# EasyEDA Pro project gorb.eprj, board PCB带接收器
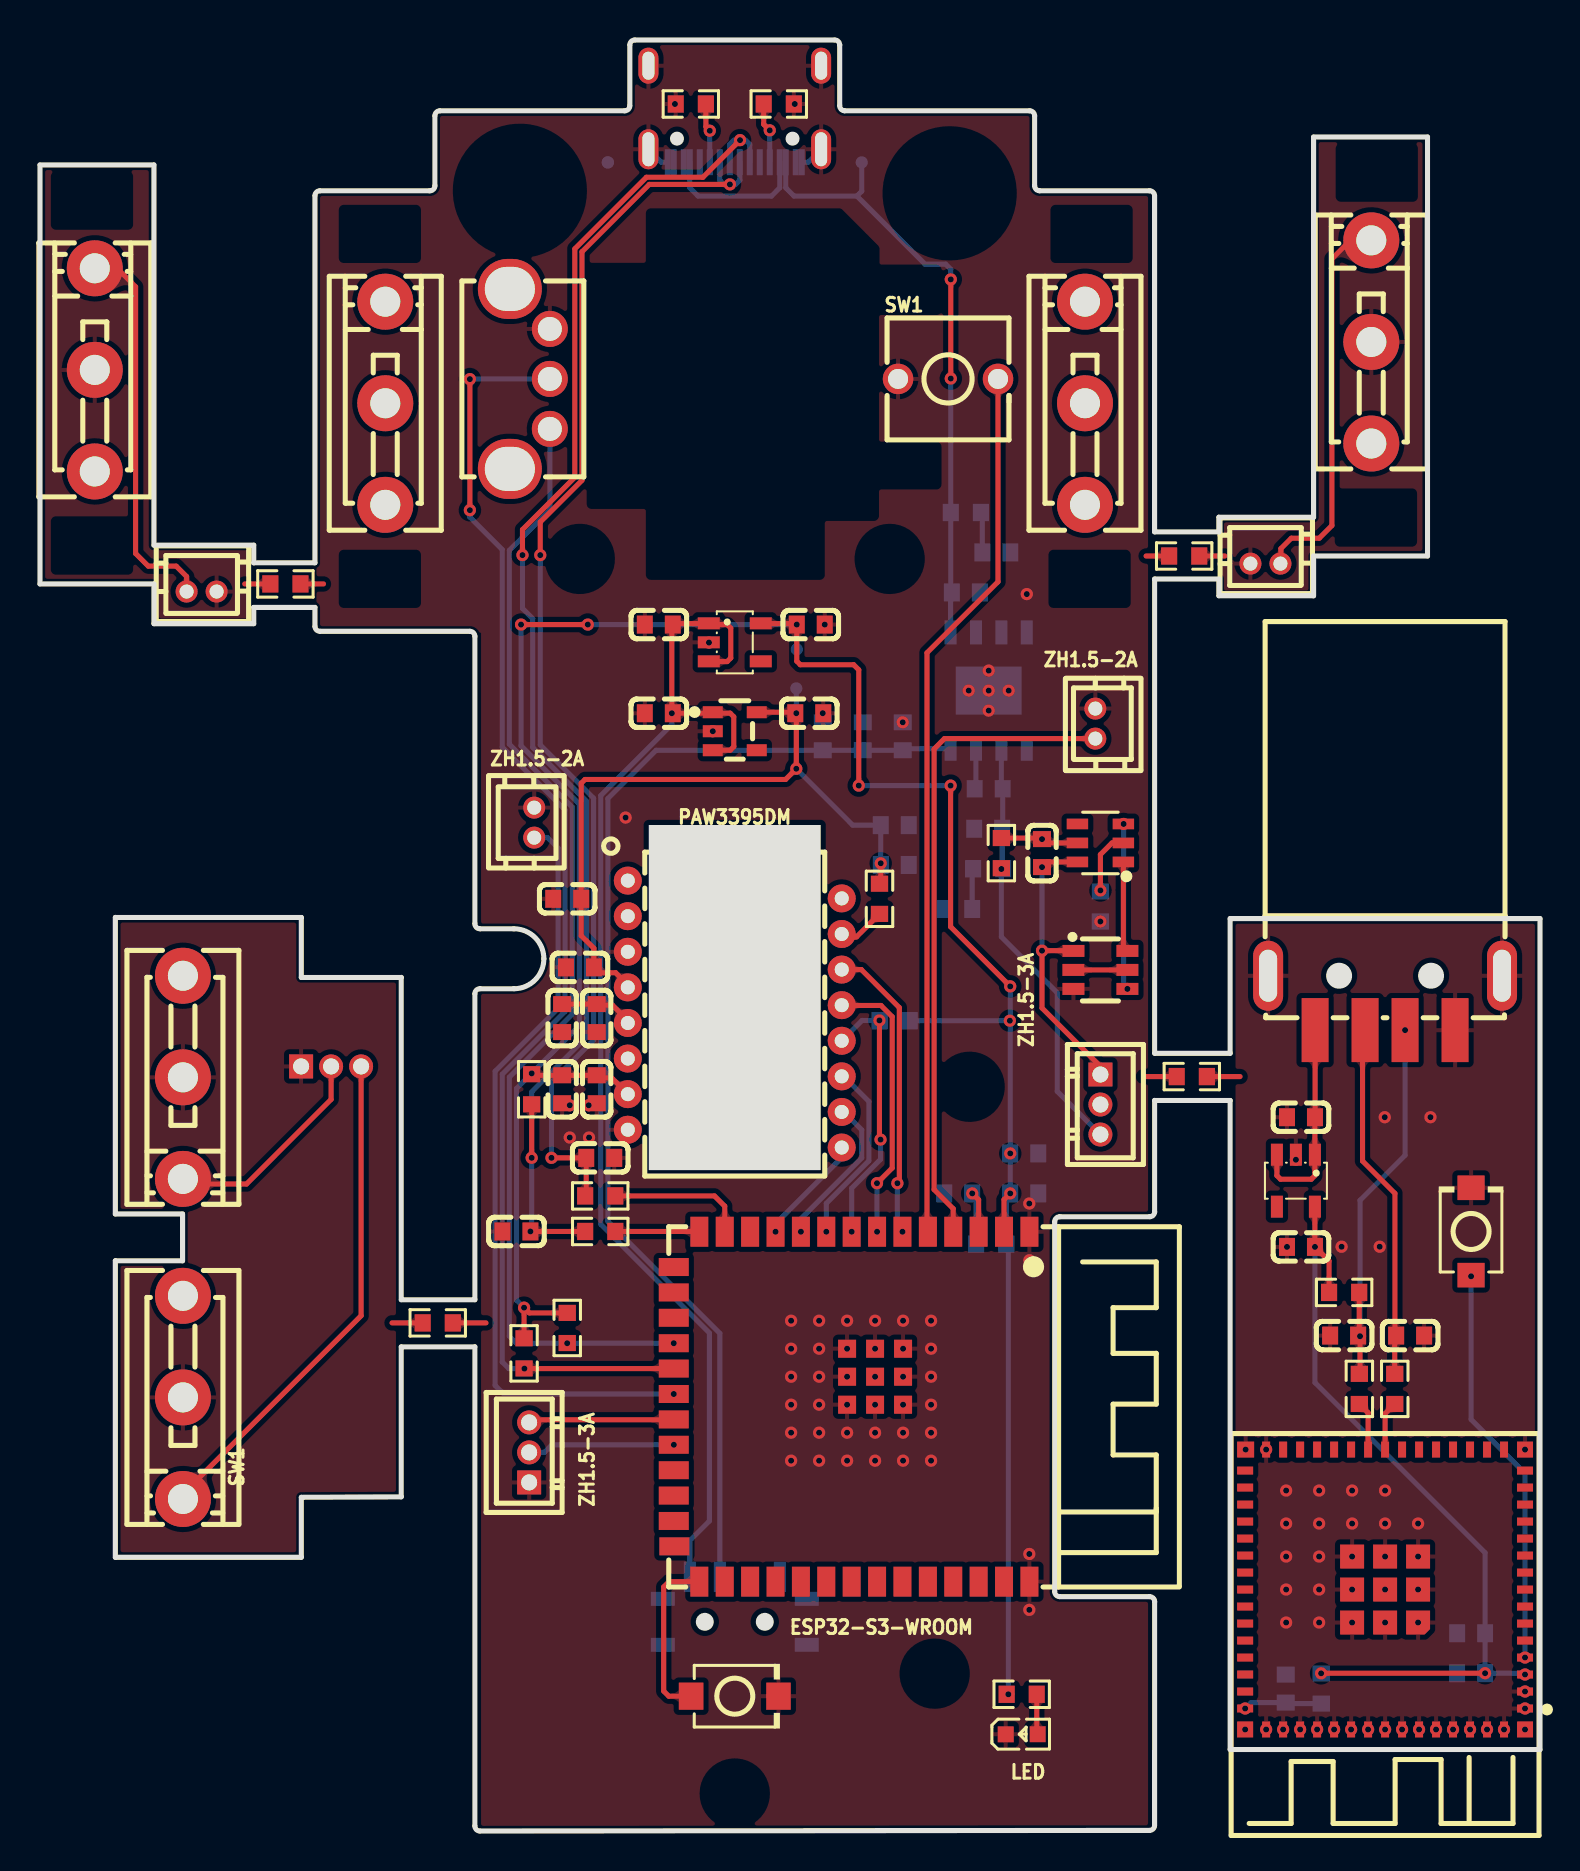
[diagram p3: board, top side]
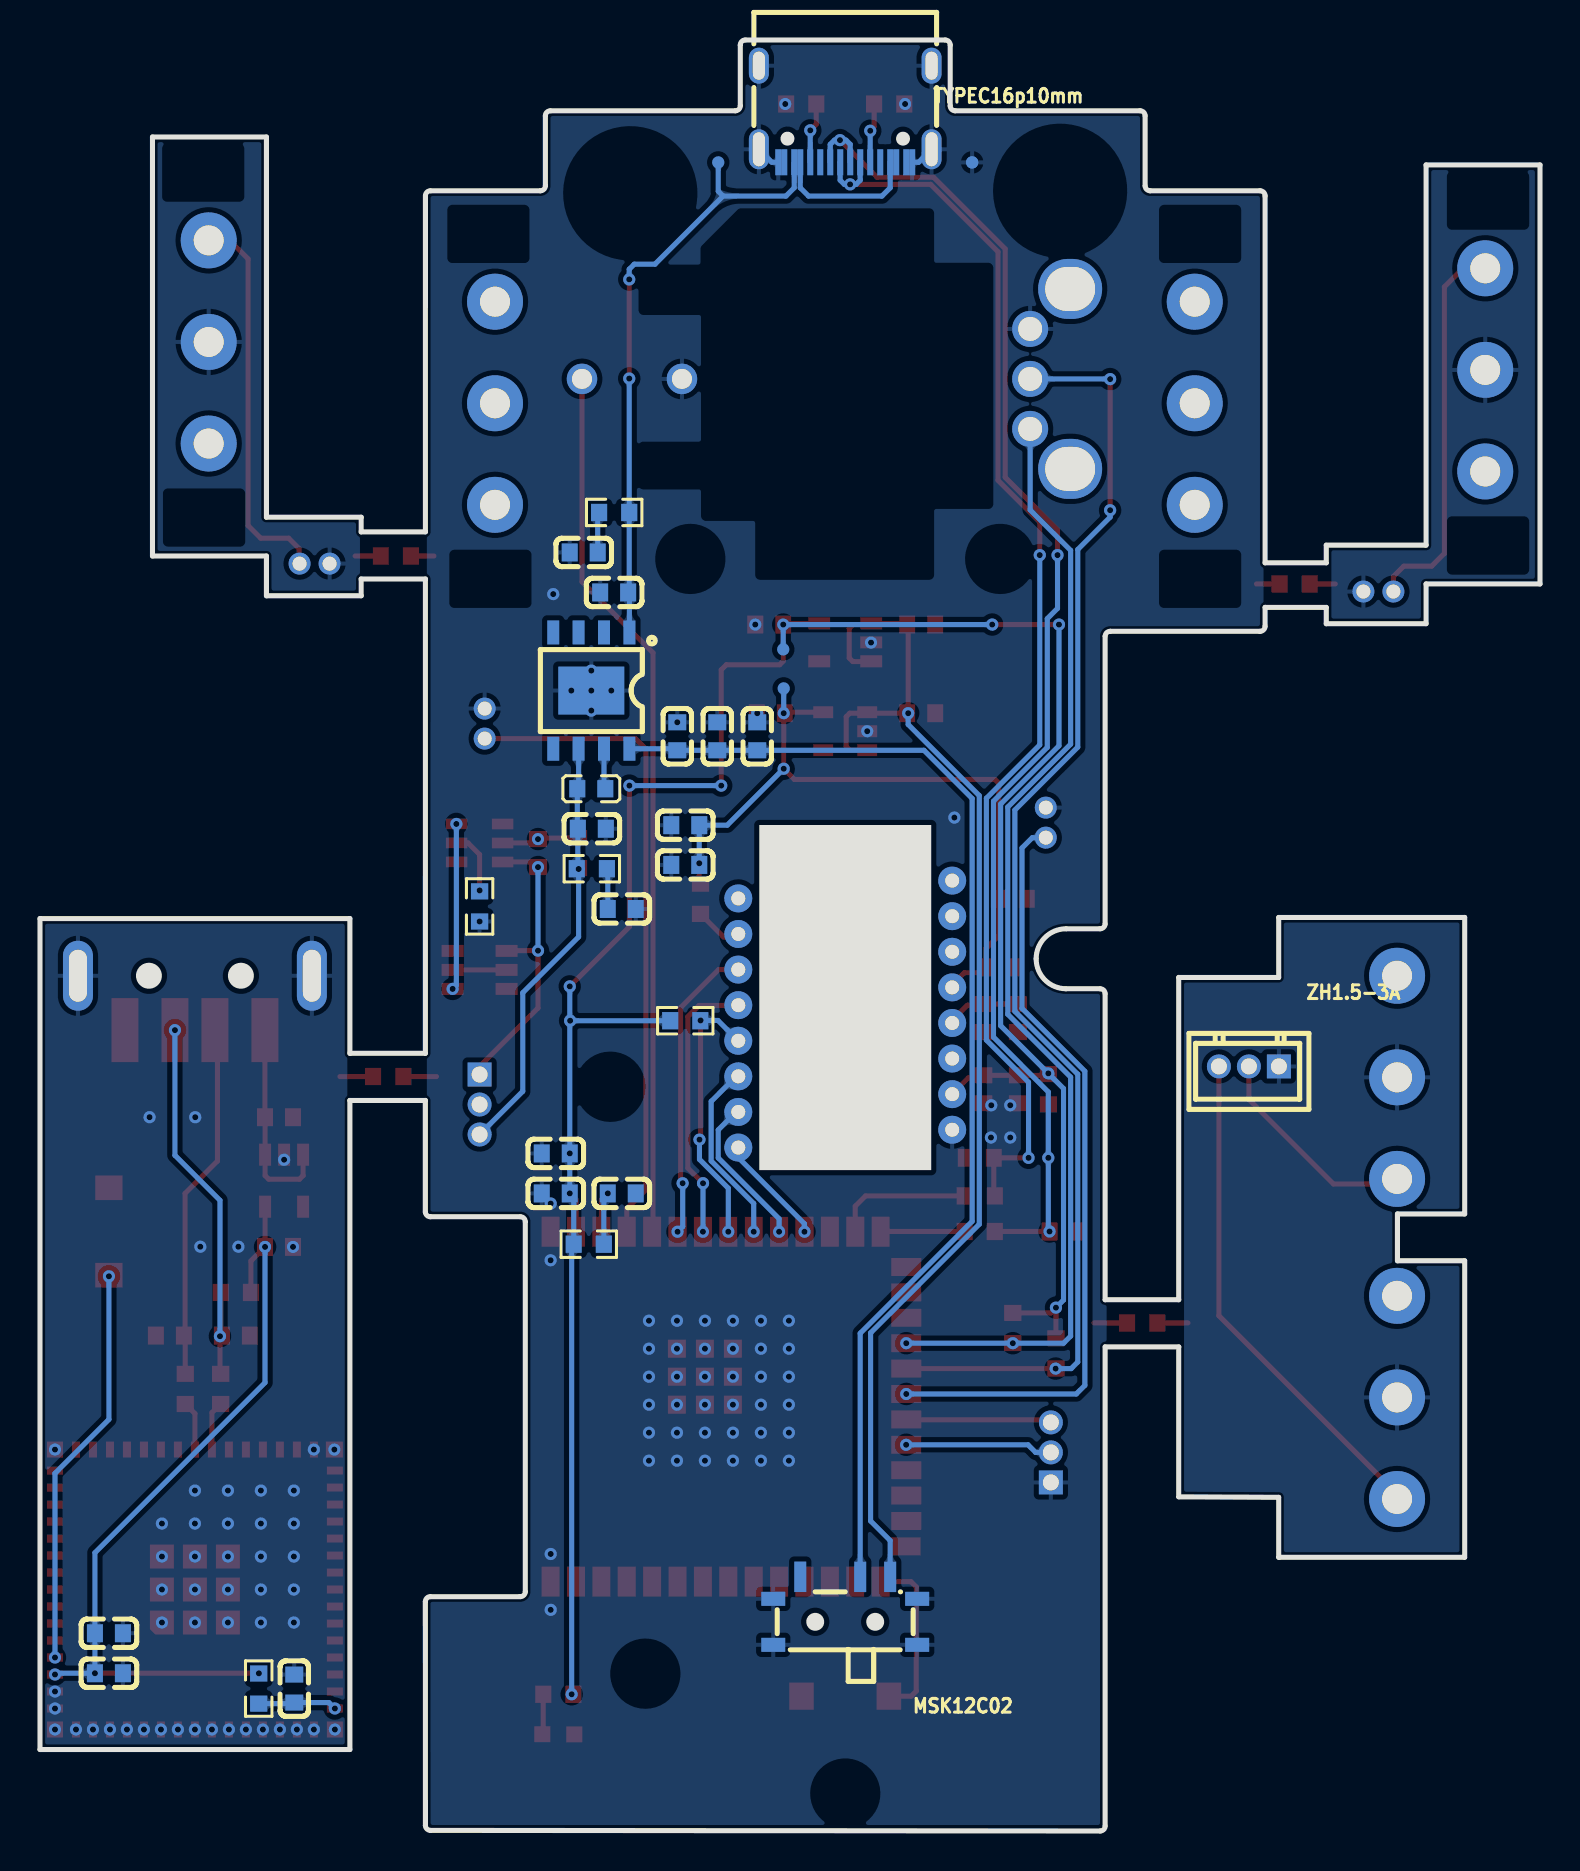
[diagram p4: board, bottom side, seen from below]

Outline 75.03 x 89.57 mm; copper layers: Top Layer, Bottom Layer. Coordinates in mm from the lower left corner of the outline.
Outline path: 0,83.32 5.7,83.32 5.7,64.31 10.69,64.31 10.69,63.42 13.75,63.42 13.75,81.78 arc(13.83,81.96) 14,82.03 19.5,82.03 arc(19.68,82.11) 19.75,82.28 19.75,85.78 arc(19.83,85.96) 20,86.03 29.25,86.03 arc(29.43,86.11) 29.5,86.28 29.5,89.32 arc(29.58,89.5) 29.75,89.57 39.75,89.57 arc(39.93,89.5) 40,89.32 40,86.28 arc(40.08,86.11) 40.25,86.03 49.5,86.03 arc(49.68,85.96) 49.75,85.78 49.75,82.28 arc(49.83,82.11) 50,82.03 55.5,82.03 arc(55.68,81.96) 55.75,81.78 55.75,64.97 58.97,64.97 58.97,65.71 63.71,65.71 63.71,84.72 69.41,84.72 69.41,63.77 63.71,63.77 63.71,61.78 58.97,61.78 58.97,62.62 55.75,62.62 55.76,38.89 59.53,38.89 59.53,45.63 75.03,45.63 75.03,4.08 59.53,4.08 59.53,36.54 55.76,36.54 55.76,30.96 arc(55.68,30.79) 55.51,30.72 51.01,30.72 arc(50.83,30.65) 50.76,30.47 50.76,11.97 arc(50.83,11.79) 51.01,11.72 55.51,11.72 arc(55.68,11.65) 55.76,11.47 55.75,0.28 arc(55.68,0.1) 55.5,0.03 22,0 arc(21.83,0.07) 21.75,0.25 21.75,24.21 18.07,24.21 18.07,16.71 13.07,16.69 13.07,13.69 3.77,13.69 3.77,28.52 7.13,28.52 7.13,30.86 3.77,30.86 3.77,45.69 13.07,45.69 13.07,42.69 18.07,42.69 18.07,26.57 21.75,26.57 21.75,41.87 arc(21.83,42.05) 22,42.12 23.7,42.12 arc(24.77,42.56) 25.2,43.62 arc(24.77,44.68) 23.7,45.12 22,45.12 arc(21.83,45.2) 21.75,45.37 21.75,59.75 arc(21.68,59.93) 21.5,60 14,60 arc(13.83,60.07) 13.75,60.25 13.75,61.2 10.69,61.2 10.69,60.38 5.7,60.38 5.7,62.37 0,62.37 0,83.32
Stack: Top Layer 0.035mm / Dielectric1 1.51mm FR4 er 4.5 / Bottom Layer 0.035mm

## Design rules (mm)
template: JLCPCB Capability(Two Layers Board)
spacing copperThickness1oz (default): track to track 0.102, other pairs 0.152 to 0.3
spacing copperThickness2oz: track to track 0.203, other pairs 0.152 to 0.3
track width copperThickness1oz (default): min 0.127, default 0.254, max 2.54
track width copperThickness2oz: min 0.203, default 0.254, max 2.54
differential pair differentialPair (default): width min 0.127, default 0.254, max 2.54; gap min 0.152, default 0.152
via viaSize (default): diameter min 0.5, default 0.61, max 10; hole min 0.3, default 0.305, max 6.3

## Placement (name value [footprint] x y rotation side)
C1  0.1uF  [C0603]  50.12 48.91 90 top
C2  -  [C0603]  43.16 54.75 90 bottom
C2#2  -  [C0603]  41.16 54.75 90 bottom
C21  22uF  [C0603]  39.16 54.75 90 bottom
C22  10uF  [C0603]  46.31 61.94 180 bottom
C23  -  [C0603]  45.93 46.11 0 bottom
C23#2  -  [C0603]  47.84 63.94 180 bottom
C24  10uF  [C0603]  47.43 50.13 180 bottom
C25  -  [C0603]  63.08 35.7 0 top
C25#2  -  [C0603]  63.08 29.21 0 top
C25#3  -  [C0603]  30.95 55.9 0 top
C25#4  -  [C0603]  38.48 55.9 0 top
C25#5  -  [C0603]  38.56 60.34 0 top
C25#6  -  [C0603]  30.95 60.34 0 top
C26  -  [C0603]  49.23 31.89 0 bottom
C26#2  -  [C0603]  71.59 7.89 180 bottom
C27  -  [C0603]  71.59 9.89 180 bottom
C27#2  -  [C0603]  49.23 33.89 0 bottom
C28  0.1uF  [C0603]  45.93 31.89 180 bottom
C29  12pF  [C0603]  23.83 29.98 0 top
C30  12pF  [C0603]  28.02 33.67 0 top
C31  -  [C0603]  26.12 37.1 270 top
C31#2  -  [C0603]  27.85 37.1 270 top
C31#3  -  [C0603]  27.85 40.66 270 top
C31#4  -  [C0603]  26.12 40.66 270 top
C32  0.1uF  [C0603]  27.01 43.19 0 top
C33  10uF  [C0603]  26.37 46.62 0 top
C34  -  [C0603]  42.76 50.3 180 bottom
C34#2  -  [C0603]  42.76 48.32 180 bottom
C35  12pF  [C0603]  65.23 24.78 0 top
C36  12pF  [C0603]  68.54 24.78 0 top
C37  0.1uF  [C0603]  62.31 7.12 270 bottom
ESP32-S3-WROOM  ESP32-S3-WROOM-1-N16R8  [WIRELM-SMD_ESP32-S3-WROOM-1]  40.6 21.22 270 top
LED  LED灯,0603,红色  [LED0603-RD_RED]  49.11 4.84 0 top
MSK12C02  MSK12C02  [SW-TH_MSK12C02]  34.75 11.01 180 bottom
NOREF  -  [Pad_e11927]  37.83 57.14 0 top
NOREF#2  -  [Pad_e13684]  28.41 83.45 0 top
NOREF#3  -  [Pad_e11570]  37.85 59.1 0 top
NOREF#4  -  [Pad_e13683]  28.41 83.45 0 top
NOREF#5  -  [Pad_e13609]  41.1 83.45 0 top
PAW3395DM  PAW3395DM-T6QU  [DIP-16_PAW3395DM-T6QU]  34.75 40.86 0 top
Q1  8205A  [SOT-23-6_L2.9-W1.6-P0.95-LS2.8-BR]  53.04 43.06 180 top
R2  5.1kΩ  [R0603]  32.56 86.37 180 top
R3  5.1kΩ  [R0603]  36.95 86.37 180 top
R4  1kΩ  [R0603]  53.04 46.24 90 bottom
R5  100Ω  [R0603]  48.09 48.91 90 top
R6  -  [R0603]  47.43 48.13 0 bottom
R6#2  -  [R0603]  46.31 65.94 180 bottom
R7  10kΩ  [R0603]  47.58 29.35 180 bottom
R8  -  [R0603]  24.59 37.1 90 top
R8#2  -  [R0603]  65.23 26.94 180 top
R9  22Ω  [R0603]  28.02 29.98 0 top
R10  22Ω  [R0603]  28.02 31.76 0 top
R11  10kΩ  [R0603]  24.21 23.89 90 top
R12  10kΩ  [R0603]  26.37 25.16 90 top
R13  5.6Ω  [R0603]  41.99 46.62 90 top
R14  10kΩ  [R0603]  42.76 40.53 180 bottom
R16  -  [R0603]  66 22.11 90 top
R16#2  -  [R0603]  67.76 22.11 90 top
R17  10kΩ  [R0603]  64.09 7.12 90 bottom
R19  1kΩ  [R0603]  49.11 6.84 0 top
R20  -  [R0603]  19.9 25.41 0 top
R20#2  -  [R0603]  57.62 37.73 0 top
R21  0  [R0603]  12.28 62.37 0 top
R22  0  [R0603]  57.23 63.77 0 top
SW1  -  [SW-TH_K9-1267T]  7.15 21.69 270 top
SW1#2  -  [SW-TH_L6.2-W6.2-P5.00]  45.42 72.62 0 top
SW2  -  [SW-TH_K9-1267T]  7.15 37.69 270 top
SW2#2  -  [SW-TH_K9-1267T]  52.27 71.41 90 top
SW3  -  [SW-SMD_L3.9-W3.0-P4.45]  34.75 6.74 0 top
SW3#2  -  [SW-SMD_L3.9-W3.0-P4.45]  71.59 29.98 90 top
SW3#3  -  [SW-TH_K9-1267T]  2.74 73.07 90 top
SW3#4  -  [SW-TH_K9-1267T]  66.59 74.47 90 top
SW3#5  -  [SW-TH_K9-1267T]  17.27 71.41 90 top
SW4  EC10E1220501  [SW-TH_EC10EXXXXXXX]  24.5 72.62 90 top
TYPEC16p10mm  -  [USB-C-SMD_KH-TYPE-C-16P]  34.75 85.87 0 bottom
U6  IP5306  [ESOP-8_L4.9-W3.9-P1.27-LS6.0-BL-EP]  47.45 57.03 0 bottom
U8  DW01A  [SOT-23-6_L2.9-W1.6-P0.95-LS2.8-BL]  53.04 49.42 90 top
U10  TLV75519PDBVR  [SOT-23-5_L2.9-W1.6-P0.95-LS2.8-BR]  34.75 55 180 top
U11  1uH  [L0603]  47.45 52.13 180 bottom
U12  2.4GHz  [WIFI-SMD_ESP32-MINI-1-N4]  67.28 12.08 180 top
U15  -  [SOT-23-5_L3.0-W1.7-P0.95-LS2.8-BR]  34.75 59.45 180 top
U15#2  -  [SOT-23-5_L3.0-W1.7-P0.95-LS2.8-BR]  62.82 32.52 90 top
USB1  AM 180°  [USB-SMD_AM180]  67.28 41.41 180 top
ZH1.5-2A  -  [CONN-TH_ZH-1.5-2A]  24.72 50.43 90 top
ZH1.5-2A#2  -  [CONN-TH_ZH-1.5-2A]  52.79 55.38 270 top
ZH1.5-2A#3  -  [CONN-TH_ZH-1.5-2A]  8.08 61.99 0 top
ZH1.5-2A#4  -  [CONN-TH_ZH-1.5-2A]  61.3 63.39 0 top
ZH1.5-3A  -  [CONN-TH_ZH1.5-3A]  24.47 18.94 90 top
ZH1.5-3A#2  -  [CONN-TH_ZH1.5-3A]  53.04 36.33 270 top
ZH1.5-3A#3  -  [CONN-TH_ZH1.5-3A]  14.56 38.24 0 bottom

## Footprints (pads in the part's own frame, mm; a bottom-side part is the same pattern mirrored in y, then rotated)
C0603
  rect 0.8x0.9 smd: 1(-0.7,0) 2(0.7,0)
CONN-TH_ZH1.5-3A
  rect 1.2x1.2 hole 0.8: 1(-1.5,0)
  round 1.2 hole 0.8: 2(0.001,0) 3(1.5,0)
CONN-TH_ZH-1.5-2A
  round 1.1 hole 0.7: 1(-0.75,0) 2(0.75,0)
DIP-16_PAW3395DM-T6QU
  round 1.4 hole 0.7: 1(-5.35,6.675) 2(-5.35,4.895) 3(-5.35,3.115) 4(-5.35,1.335) 5(-5.35,-0.445) 6(-5.35,-2.225) 7(-5.35,-4.005) 8(-5.35,-5.785) 9(5.35,-6.675) 10(5.35,-4.895) 11(5.35,-3.115) 12(5.35,-1.335) 13(5.35,0.445) 14(5.35,2.225) 15(5.35,4.005) 16(5.35,5.785)
ESOP-8_L4.9-W3.9-P1.27-LS6.0-BL-EP
  rect 0.6x1.2 smd: 1(-1.905,-2.909) 2(-0.635,-2.909) 3(0.635,-2.909) 4(1.905,-2.909) 5(1.905,2.909) 6(0.635,2.909) 7(-0.635,2.909) 8(-1.905,2.909)
  rect 3.3x2.4 smd: 9(0,0)
L0603
  rect 0.8x0.864 smd: 1(-0.7,0) 2(0.7,0)
LED0603-RD_RED
  rect 0.8x0.8 smd: 1(-0.799,-0.004) 2(0.799,0.004)
Pad_e11570
  round 0.61 smd far side: (0,0)
Pad_e11927
  round 0.61 smd far side: (0,0)
Pad_e13609
  round 0.61 smd far side: TP2(0,0)
Pad_e13683
  round 0.61 smd far side: TP3(0,0)
Pad_e13684
  round 0.61 smd far side: TP4(0,0)
R0603
  rect 0.806x0.864 smd: 1(-0.753,0) 2(0.753,0)
SOT-23-5_L2.9-W1.6-P0.95-LS2.8-BR
  rect 1x0.6 smd: 1(1.1,-0.95) 2(1.1,0) 3(1.1,0.95) 4(-1.1,0.95) 5(-1.1,-0.95)
SOT-23-5_L3.0-W1.7-P0.95-LS2.8-BR
  rect 1.1x0.6 smd: 1(1.3,-0.95) 2(1.3,0) 3(1.3,0.95) 4(-1.3,0.95) 5(-1.3,-0.95)
SOT-23-6_L2.9-W1.6-P0.95-LS2.8-BL
  rect 0.532x1.072 smd: 1(-0.95,-1.149) 2(0,-1.149) 3(0.95,-1.149) 4(0.95,1.149) 5(0,1.149) 6(-0.95,1.149)
SOT-23-6_L2.9-W1.6-P0.95-LS2.8-BR
  rect 1.1x0.6 smd: 1(1.35,-0.95) 2(1.35,0) 3(1.35,0.95) 4(-1.35,0.95) 5(-1.35,0) 6(-1.35,-0.95)
SW-SMD_L3.9-W3.0-P4.45
  rect 1.23x1.36 smd: 1(-2.185,0) 2(2.185,0)
SW-TH_EC10EXXXXXXX
  oval 3x3.2 hole 2.2x2.5: 4(-4.5,1) 5(4.5,1)
  round 1.8 hole 1.2: A(-2.5,-1) B(0,-1) C(2.5,-1)
SW-TH_K9-1267T
  round 2.8 hole 1.5: 1(-5.08,0) 2(0,0) 3(5.08,0)
SW-TH_L6.2-W6.2-P5.00
  round 1.524 hole 1: 1(-2.5,0) 2(2.5,0)
SW-TH_MSK12C02
  rect 0.6x1.524 smd: 1(-2.25,1.7) 2(0.75,1.7) 3(2.25,1.7)
  rect 1.2x0.7 smd: 4(-3.6,-1.7) 4(-3.6,0.6) 4(3.6,-1.7) 4(3.6,0.6)
USB-C-SMD_KH-TYPE-C-16P
  oval 1x2 hole 0.6x1.7: 1(-4.32,1.765) 2(4.32,1.765)
  oval 1x1.8 hole 0.6x1.4: 3(-4.32,-2.415) 4(4.32,-2.415)
  rect 0.3x1.3 smd: A1(-3.35,2.415) A4(-2.55,2.415) A5(-1.25,2.415) A6(-0.25,2.415) A7(0.25,2.415) A8(1.25,2.415) A9(2.55,2.415) A12(3.35,2.415) B1(3.05,2.415) B4(2.25,2.415) B5(1.75,2.415) B6(0.75,2.415) B7(-0.75,2.415) B8(-1.75,2.415) B9(-2.25,2.415) B12(-3.05,2.415)
USB-SMD_AM180
  rect 1.35x3.2 smd: 1(3.5,1.36) 2(1,1.36) 3(-1,1.36) 4(-3.5,1.36)
  oval 1.5x3.5 hole 0.9x2.6: 5(-5.85,-1.36) 5(5.85,-1.36)
WIFI-SMD_ESP32-MINI-1-N4
  rect 0.8x0.4 smd: 1(-7,5.95) 2(-7,5.1) 3(-7,4.25) 4(-7,3.4) 5(-7,2.55) 6(-7,1.7) 7(-7,0.85) 8(-7,0.001) 9(-7,-0.85) 10(-7,-1.7) 11(-7,-2.55) 12(-7,-3.4) 13(-7,-4.25) 14(-7,-5.1) 15(-7,-5.949) 31(7,-5.95) 32(7,-5.1) 33(7,-4.25) 34(7,-3.4) 35(7,-2.55) 36(7,-1.7) 37(7,-0.85) 38(7,-0.001) 39(7,0.85) 40(7,1.7) 41(7,2.55) 42(7,3.4) 43(7,4.25) 44(7,5.1) 45(7,5.949)
  rect 0.4x0.8 smd: 16(-5.95,-7) 17(-5.1,-7) 18(-4.25,-7) 19(-3.4,-7) 20(-2.55,-7) 21(-1.7,-7) 22(-0.85,-7) 23(-0.001,-7) 24(0.85,-7) 25(1.7,-7) 26(2.55,-7) 27(3.4,-7) 28(4.25,-7) 29(5.1,-7) 30(5.949,-7) 46(5.95,7) 47(5.1,7) 48(4.25,7) 49(3.4,7) 50(2.55,7) 51(1.7,7) 52(0.85,7) 53(0,7) 54(-0.85,7) 55(-1.7,7) 56(-2.55,7) 57(-3.4,7) 58(-4.25,7) 59(-5.1,7) 60(-5.95,7)
  custom 1.2x1.2 smd: 61(-1.65,1.65)
  rect 1.2x1.2 smd: 61(-1.65,0) 61(-1.65,-1.65) 61(0,1.65) 61(0,0) 61(0,-1.65) 61(1.649,-1.65) 61(1.65,1.65) 61(1.65,0)
  rect 0.8x0.8 smd: 62(-7,7) 63(-7,-7) 65(7,7)
  rect 0.85x0.8 smd: 64(6.975,-7)
WIRELM-SMD_ESP32-S3-WROOM-1
  rect 1.5x0.9 smd: 1(-8.75,8.895) 2(-8.75,7.625) 3(-8.75,6.355) 4(-8.75,5.085) 5(-8.75,3.815) 6(-8.75,2.545) 7(-8.75,1.275) 8(-8.75,0.005) 9(-8.75,-1.265) 10(-8.75,-2.535) 11(-8.75,-3.805) 12(-8.75,-5.075) 13(-8.75,-6.345) 14(-8.75,-7.615) 27(8.75,-7.615) 28(8.75,-6.345) 29(8.75,-5.075) 30(8.75,-3.805) 31(8.75,-2.535) 32(8.75,-1.265) 33(8.75,0.005) 34(8.75,1.275) 35(8.75,2.545) 36(8.75,3.815) 37(8.75,5.085) 38(8.75,6.355) 39(8.75,7.625) 40(8.75,8.895)
  rect 0.9x1.5 smd: 15(-6.985,-8.895) 16(-5.715,-8.895) 17(-4.445,-8.895) 18(-3.175,-8.895) 19(-1.905,-8.895) 20(-0.635,-8.895) 21(0.635,-8.895) 22(1.905,-8.895) 23(3.175,-8.895) 24(4.445,-8.895) 25(5.715,-8.895) 26(6.985,-8.865)
  rect 0.9x0.9 smd: 41(-2.9,2.575) 41(-2.9,1.175) 41(-2.9,-0.225) 41(-1.5,2.575) 41(-1.5,1.175) 41(-1.5,-0.225) 41(-0.1,2.575) 41(-0.1,1.175) 41(-0.1,-0.225)

## Nets
1V9: C25#4.1 C32.2 C33.2 C34.2 C34#2.2 NOREF. PAW3395DM.4 R13.2 U10.5
3V3: C25#5.1 C26.1 C27#2.1 C31.1 C31#2.1 ESP32-S3-WROOM.2 NOREF#3. PAW3395DM.7 R7.1 R8.2 R11.2 R12.2 R14.1 R19.1 U15.5
3V3_2: C25#2.2 C26#2.1 C27.1 R8#2.2 R17.2 U12.3 U15#2.5
5V: C22.2 NOREF#5.TP2 R6#2.2 TYPEC16p10mm.A4 TYPEC16p10mm.A9 TYPEC16p10mm.B4 TYPEC16p10mm.B9 U6.1
5V_2: C25.2 U15#2.1 U15#2.3 USB1.1
GND: C2.2 C2#2.2 C21.2 C22.1 C23.1 C23#2.1 C24.2 C25#3.1 C25#4.2 C25#5.2 C25#6.1 C26.2 C27#2.2 C29.1 C30.2 C31.2 C31#2.2 C31#3.2 C31#4.2 C32.1 C33.1 C34.1 C34#2.1 ESP32-S3-WROOM.1 ESP32-S3-WROOM.40 ESP32-S3-WROOM.41 LED.1 MSK12C02.4 NOREF#2.TP4 NOREF#4.TP3 PAW3395DM.3 PAW3395DM.8 Q1.3 R2.2 R3.1 R4.1 SW1#2.1 SW3.2 SW4.C TYPEC16p10mm.1 TYPEC16p10mm.2 TYPEC16p10mm.3 TYPEC16p10mm.4 TYPEC16p10mm.A1 TYPEC16p10mm.A12 TYPEC16p10mm.B1 TYPEC16p10mm.B12 U6.9 U10.2 U15.2 ZH1.5-2A.2 ZH1.5-2A#2.1 ZH1.5-3A.1
GND_1: SW1.2 SW2.2 ZH1.5-3A#3.1
GND_2: C25.1 C25#2.1 C26#2.2 C27.2 C35.1 C36.2 C37.1 SW3#2.2 U12.1 U12.2 U12.30 U12.46 U12.47 U12.48 U12.49 U12.50 U12.51 U12.52 U12.53 U12.54 U12.55 U12.56 U12.57 U12.58 U12.59 U12.60 U12.61 U12.62 U12.63 U12.64 U12.65 U15#2.2 USB1.4 USB1.5
GND_3: SW3#3.2 ZH1.5-2A#3.2
GND_4: SW3#4.2 ZH1.5-2A#4.1
VBUS: C2.1 C2#2.1 C21.1 MSK12C02.2 U6.8
VBUS_ON: C25#3.2 C25#6.2 MSK12C02.3 U10.1 U10.3 U15.1 U15.3
VDD: C1.2 R5.2 U8.5
VDDREG: C31#3.1 C31#4.1 PAW3395DM.5
VIN_RC: C23#2.2 R6#2.1
B+: C24.1 R5.1 R6.2 U6.6 U11.1 ZH1.5-3A#2.3
B-: C1.1 Q1.1 U8.6 ZH1.5-3A#2.1
BAT_RC: C23.2 R6.1
CC1: R2.1 TYPEC16p10mm.A5
CC2: R3.2 TYPEC16p10mm.B5
CO-G2: Q1.4 U8.3
CSI: R4.2 U8.2
D1/D2: Q1.2 Q1.5
D+: C29.2 R8.1 R9.1 TYPEC16p10mm.A6 TYPEC16p10mm.B6
D+_2: C35.2 R8#2.1 R16.2 USB1.3
D-: C30.1 R10.1 TYPEC16p10mm.A7 TYPEC16p10mm.B7
D-_2: C36.1 R16#2.2 USB1.2
DO-G1: Q1.6 U8.1
EN: C28.1 ESP32-S3-WROOM.3 R7.2
EN_2: C37.2 R17.1 U12.45
IO0: ESP32-S3-WROOM.27 SW3.1
IO0_2: SW3#2.1 U12.4
IO3: ESP32-S3-WROOM.15
IO4: ESP32-S3-WROOM.4 ZH1.5-2A#2.2
IO4_1: SW3#4.3 ZH1.5-2A#4.2
IO5: ESP32-S3-WROOM.5 SW1#2.2
IO8: ESP32-S3-WROOM.12
IO9: ESP32-S3-WROOM.17
IO10: ESP32-S3-WROOM.18 R12.1 SW4.A
IO11: ESP32-S3-WROOM.19 R11.1 SW4.B
IO12: ESP32-S3-WROOM.20 ZH1.5-2A.1
IO12_1: SW3#3.3 ZH1.5-2A#3.1
IO13: ESP32-S3-WROOM.21 ZH1.5-3A.3
IO13_1: SW1.3 ZH1.5-3A#3.3
IO14: ESP32-S3-WROOM.22 ZH1.5-3A.2
IO14_1: SW2.3 ZH1.5-3A#3.2
IO19: ESP32-S3-WROOM.13 R10.2
IO19_1: R16#2.1 U12.23
IO20: ESP32-S3-WROOM.14 R9.2
IO20_1: R16.1 U12.24
IO21: ESP32-S3-WROOM.23
IO45: ESP32-S3-WROOM.26
IO46: ESP32-S3-WROOM.16
KEY: U6.5
LED_1: U6.2
LED_2: U6.3
LED_3: U6.4
LED_+: LED.2 R19.2
LED_P: PAW3395DM.15 R13.1
MISO: ESP32-S3-WROOM.8 PAW3395DM.12 R14.2
MOSI: ESP32-S3-WROOM.9 PAW3395DM.11
MOTION: ESP32-S3-WROOM.11 PAW3395DM.9
NCS: ESP32-S3-WROOM.7 PAW3395DM.13
NRESET: ESP32-S3-WROOM.6 PAW3395DM.14
NTC: ZH1.5-3A#2.2
SCLK: ESP32-S3-WROOM.10 PAW3395DM.10
SW: U6.7 U11.2

Pads without a net: C28 2; ESP32-S3-WROOM 24 25 28 29 30 31 32 33 34 35 36 37 38 39; MSK12C02 1; PAW3395DM 1 2 6 16; R20 1 2; R20#2 1 2; R21 1 2; R22 1 2; SW1 1; SW2 1; SW2#2 1 2 3; SW3#3 1; SW3#4 1; SW3#5 1 2 3; SW4 4 5; TYPEC16p10mm A8 B8; U8 4; U10 4; U12 5 6 7 8 9 10 11 12 13 14 15 16 17 18 19 20 21 22 25 26 27 28 29 31 32 33 34 35 36 37 38 39 40 41 42 43 44; U15 4; U15#2 4

## Via types
v1: diameter 0.61, hole 0.305, Top Layer to Bottom Layer, 172 vias

## Routing (per net, layer and track width the routed paths; a pad name or vN(x,y) marks a point on that pad's centre or on a via; arc(x,y) is an arc through that point)
1V9: length 36.8
  Top Layer w0.254: R13.2 42.06,47.44 v1(42.06,48.4) ; U10.5 37.73,55.95 C25#4.1 ; v1(37.83,55.9) v1(37.83,53.13) 37.29,52.59 27.26,52.59 27.07,52.4 C33.2 27.07,44.78 27.71,44.14 C32.2 27.71,43.19 27.97,42.93 28.79,42.93 29.03,42.69 29.39,42.69 29.4,42.7
  Bottom Layer w0.254: v1(37.83,53.13) 40.65,50.3 41.99,50.3 42.06,50.24 v1(42.06,48.4) 42.06,48.32 ; v1(37.83,55.9) 37.83,57.14
3V3: length 132.2
  Top Layer w0.254: v1(45.55,52.28) 45.55,45.22 v1(48.53,42.24) ; R12.2 24.48,25.91 v1(24.21,26.17) R11.2 ; C31#2.1 27.97,37.67 28.59,37.67 29.4,36.86 PAW3395DM.7 ; 27.85,37.79 24.65,37.79 R8.2 ; 36,60.39 37.81,60.39 v1(37.85,60.34) 37.85,58.51 38.03,58.33 40.7,58.33 40.96,58.07 v1(40.96,52.28) ; v1(27.4,60.34) v1(24.06,60.34) ; ESP32-S3-WROOM.2 48.22,31.58 v1(48.53,31.89)
  Bottom Layer w0.254: v1(48.53,42.24) v1(48.53,33.89) v1(48.53,31.89) 48.34,31.69 R7.1 48.44,29.25 v1(48.44,6.84) ; v1(27.4,60.34) v1(37.85,60.34) 37.85,59.1 ; v1(40.96,52.28) 45.6,52.28 ; v1(24.06,60.34) 24.06,54.27 26.98,51.36 26.98,40.28 v1(24.59,37.89) 23.84,37.13 23.84,26.55 v1(24.21,26.17) ; R14.1 v1(48.51,40.53)
3V3_2: length 39.7
  Top Layer w0.254: v1(63.78,29.21) 64.48,28.51 R8#2.2 ; v1(64.08,7.89) 64.09,7.89 v1(72.28,7.89) ; 63.77,29.1 63.77,31.15 63.78,31.15
  Bottom Layer w0.254: v1(63.78,29.21) 63.78,22.43 72.28,13.92 C27.1 v1(72.28,7.89) 74.22,7.89 v1(74.28,7.83)
5V: length 38.4
  Top Layer w0.254: v1(45.56,72.64) v1(45.56,77.6)
  Bottom Layer w0.254: R6#2.2 v1(45.56,72.64) ; v1(45.56,77.6) 45.56,78.11 45.3,78.36 44.27,78.36 40.86,81.77 ; NOREF#5.TP2 41.1,82.01 40.86,81.77 ; 40.86,81.77 37.72,81.77 37.3,82.18 TYPEC16p10mm.A9 ; 45.56,65.8 45.56,61.93 45.55,61.93 U6.1 ; TYPEC16p10mm.B9 32.5,82.18 32.92,81.77 36.59,81.77 37,82.18 TYPEC16p10mm.B4
5V_2: length 10.1
  Top Layer w0.254: 61.87,33.65 61.87,32.78 62.05,32.6 63.59,32.6 63.77,32.78 U15#2.1 63.77,35.7 ; USB1.1 63.78,35.83
GND: length 2.5
  Bottom Layer w0.254: TYPEC16p10mm.2 38.42,83.46 TYPEC16p10mm.A12 ; TYPEC16p10mm.A1 31.08,83.46 TYPEC16p10mm.1
  vias: v1(26.5,36.3) v1(26.5,34.68) v1(27.45,36.3) v1(27.47,34.68) v1(29.29,50.69) v1(31.76,86.37) v1(33.46,59.44) v1(33.66,55) v1(37.57,25.52) v1(37.57,24.12) v1(37.57,22.72) v1(37.57,21.32) v1(37.57,19.92) v1(37.57,18.52) v1(37.75,86.37) v1(38.97,25.52) v1(38.97,24.12) v1(38.97,22.72) v1(38.97,21.32) v1(38.97,19.92) v1(38.97,18.52) v1(39.16,55.9) v1(39.25,60.34) v1(40.37,25.52) v1(40.37,24.12) v1(40.37,22.72) v1(40.37,21.32) v1(40.37,19.92) v1(40.37,18.52) v1(41.77,25.52) v1(41.77,24.12) v1(41.77,22.72) v1(41.77,21.32) v1(41.77,19.92) v1(41.77,18.52) v1(43.16,55.45) v1(43.17,25.52) v1(43.17,24.12) v1(43.17,22.72) v1(43.17,21.32) v1(43.17,19.92) v1(43.17,18.52) v1(44.57,25.52) v1(44.57,24.12) v1(44.57,22.72) v1(44.57,21.32) v1(44.57,19.92) v1(44.57,18.52) v1(46.45,57.03) v1(47.45,58.03) v1(47.45,57.03) v1(47.45,56.03) v1(48.45,57.03) v1(49.36,61.86) v1(49.49,31.38) v1(49.49,28.54) v1(49.49,13.85) v1(49.49,11.06) v1(53.04,45.49)
GND_2:
  vias: v1(60.28,5.08) v1(60.31,19.08) v1(61.33,19.08) v1(61.33,5.08) v1(62.18,5.08) v1(62.38,29.21) v1(62.33,17.03) v1(62.33,15.38) v1(62.33,13.73) v1(62.33,12.08) v1(62.33,10.43) v1(62.82,33.57) v1(63.03,5.08) v1(63.88,5.08) v1(63.98,17.03) v1(63.98,15.38) v1(63.98,13.73) v1(63.98,12.08) v1(63.98,10.43) v1(64.73,5.08) v1(65.11,29.22) v1(65.58,5.08) v1(65.63,17.03) v1(65.63,15.38) v1(65.63,13.73) v1(65.63,12.08) v1(65.63,10.43) v1(66.43,5.08) v1(67.01,29.22) v1(67.27,35.7) v1(67.28,17.03) v1(67.28,15.38) v1(67.28,13.73) v1(67.28,12.08) v1(67.28,10.43) v1(67.28,5.08) v1(68.13,5.08) v1(68.93,15.38) v1(68.93,13.73) v1(68.93,12.08) v1(68.93,10.43) v1(68.98,5.08) v1(69.55,35.7) v1(69.83,5.08) v1(70.68,5.08) v1(71.53,5.08) v1(72.38,5.08) v1(73.23,5.08) v1(74.28,19.08) v1(74.28,6.98) v1(74.28,6.13) v1(74.28,5.08)
VBUS: length 59.4
  Bottom Layer w0.254: U6.8 43.19,54.13 ; MSK12C02.2 34,24.89 28.41,30.49 28.41,51.64 30.82,54.05 C21.1 C2#2.1 C2.1
VBUS_ON: length 63.2
  Top Layer w0.254: U10.1 33.61,55.9 C25#3.2 v1(31.6,55.9) 31.6,60.29 C25#6.2 31.7,60.39 33.5,60.39 33.55,60.34 34.37,60.34 34.55,60.16 34.55,58.67 34.37,58.49 33.5,58.49 ; 33.7,55.9 34.53,55.9 34.7,55.72 34.7,54.23 34.53,54.05 U10.3
  Bottom Layer w0.254: v1(31.6,55.9) 31.6,55.34 28.05,51.79 28.05,30.34 33.48,24.91 33.48,15.51 32.5,14.53 MSK12C02.3
VDD: length 3.8
  Top Layer w0.254: U8.5 50.31,49.42 v1(50.12,49.61) ; R5.2 50.07,49.66
VDDREG: length 3.6
  Top Layer w0.254: C31#4.1 C31#3.1 27.97,41.36 28.03,41.3 28.64,41.3 29.21,40.73 29.4,40.92
VIN_RC: length 1.9
  Bottom Layer w0.254: 47.07,65.92 47.14,65.85 47.14,64.02
(no net): length 11.4
  Top Layer w0.254: R20#2.1 55.2,37.73 ; R22.1 55.33,63.77 ; R21.2 14.18,62.37 ; R20#2.2 60.03,37.73 ; R22.2 59.27,63.77 ; R20.1 17.61,25.41 ; R20.2 22.31,25.41 ; R21.1 10.24,62.37
B+: length 21.3
  Bottom Layer w0.254: ZH1.5-3A#2.3 50.88,36.99 50.88,41.92 48.09,44.72 v1(48.09,48.11) 48.1,48.13 R6.2 48.13,48.18 C24.1 ; 48.13,50.34 48.16,50.36 48.16,52.34 48.09,52.4 48.09,54.13
B-: length 15
  Top Layer w0.254: 51.68,44.03 v1(50.12,44.03) 50.12,41.16 53.04,38.24 ZH1.5-3A#2.1 ; v1(50.12,48.21) 50.38,48.47 U8.6
  Bottom Layer w0.254: v1(50.12,48.21) v1(50.12,44.03)
BAT_RC: length 2
  Bottom Layer w0.254: R6.1 46.63,48.08 C23.2
CC1: length 3
  Top Layer w0.254: v1(33.5,85.03) 33.31,85.23 R2.1
  Bottom Layer w0.254: TYPEC16p10mm.A5 v1(33.5,85.03)
CC2: length 3
  Top Layer w0.254: R3.2 36.2,85.36 v1(36.5,85.05)
  Bottom Layer w0.254: TYPEC16p10mm.B5 v1(36.5,85.05)
CO-G2: length 8.3
  Bottom Layer w0.254: v1(54.39,42.11) 54.21,42.3 v1(54.21,50.36)
CSI: length 3.2
  Top Layer w0.254: v1(53.04,47.04) 53.04,48.83 53.62,49.42 U8.2
D1/D2: length 2.7
  Top Layer w0.254: Q1.5 Q1.2
D+: length 71.6
  Top Layer w0.254: v1(35.02,84.56) 33.16,82.71 30.33,82.71 26.75,79.13 26.75,67.7 24.13,65.08 v1(24.13,63.81) ; v1(24.59,33.67) R8.1 ; R9.1 v1(24.53,29.98)
  Bottom Layer w0.254: v1(24.13,63.81) 24.13,61.14 24.65,60.63 24.65,54.19 27.34,51.5 27.34,39.71 24.59,36.96 v1(24.59,33.67) 24.59,30.05 v1(24.53,29.98) ; TYPEC16p10mm.A6 34.5,84.35 34.71,84.56 v1(35.02,84.56) 35.29,84.56 35.5,84.35 TYPEC16p10mm.B6
D+_2: length 20.3
  Top Layer w0.254: R8#2.1 65.99,24.83 C35.2 ; R16.2 66.03,22.9 v1(66.03,24.75)
  Bottom Layer w0.254: v1(66.03,24.75) 66.03,31.54 68.28,33.79 v1(68.28,40.05)
D-: length 63.6
  Top Layer w0.254: v1(25.59,33.67) 27.32,33.67 27.32,31.82 R10.1 ; v1(25.02,63.81) 25.02,65.47 27.11,67.55 27.11,78.98 30.48,82.35 34.51,82.35
  Bottom Layer w0.254: v1(25.02,63.81) 25.02,54.32 27.69,51.65 27.69,39.56 25.59,37.45 v1(25.59,33.67) ; TYPEC16p10mm.A7 35.01,83.45 35.01,82.56 34.8,82.35 v1(34.51,82.35) 34.21,82.35 34,82.56 TYPEC16p10mm.B7
D-_2: length 17.8
  Top Layer w0.254: 67.78,24.84 67.78,31.89 66.16,33.51 66.16,39.93 USB1.2 ; R16#2.2 67.76,24.7
DO-G1: length 4.5
  Top Layer w0.254: U8.1 54.19,44.22 Q1.6
EN: length 4.7
  Top Layer w0.254: ESP32-S3-WROOM.3 46.95,31.57 v1(46.63,31.89)
  Bottom Layer w0.254: R7.2 46.83,31.69 v1(46.63,31.89)
EN_2: length 4
  Bottom Layer w0.254: R17.1 62.37,6.37 C37.2 60.58,6.42 v1(60.28,6.13)
IO0: length 8.6
  Top Layer w0.254: SW3.1 31.45,6.74 31.2,7 31.2,12.2 31.47,12.47 ESP32-S3-WROOM.27
IO0_2: length 20.2
  Bottom Layer w0.254: v1(71.59,27.74) 71.59,20.59 74.28,17.89 v1(74.28,8.68)
IO4: length 32.8
  Top Layer w0.254: ESP32-S3-WROOM.4 45.68,31.12 44.72,32.08 44.72,54.11 45.24,54.63 ZH1.5-2A#2.2
IO4_1: length 19.5
  Top Layer w0.254: 62.07,63.39 62.07,64.14 62.59,64.66 63.99,64.66 64.62,65.29 64.62,78.62 65.55,79.55 66.66,79.55
IO5: length 44.1
  Top Layer w0.254: SW1#2.2 47.92,62.48 44.37,58.92 44.37,30.01 ESP32-S3-WROOM.5
IO10: length 57.2
  Bottom Layer w0.254: SW4.A 25.5,66.07 23.48,64.05 23.48,54.35 26.62,51.21 26.62,40.85 23.48,37.7 23.48,24.75 23.83,24.4 v1(26.37,24.4) v1(31.7,24.4)
IO11: length 65.2
  Top Layer w0.254: ESP32-S3-WROOM.19 v1(24.23,23.13) ; v1(21.5,66.06) v1(21.5,72.61)
  Bottom Layer w0.254: 25.5,72.62 21.51,72.62 v1(21.5,72.61) ; v1(24.23,23.13) 23.45,23.13 23.12,23.45 23.12,37.85 26.27,41 26.27,51.06 23.12,54.21 23.12,64.09 21.5,65.71 v1(21.5,66.06)
IO12: length 38.7
  Bottom Layer w0.254: v1(31.7,21.86) 23.2,21.86 22.77,22.29 22.77,38 25.91,41.14 25.91,49.16 25.39,49.68 ZH1.5-2A.1
IO12_1: length 19.5
  Top Layer w0.254: SW3#3.3 3.86,78.15 4.78,77.23 4.78,63.89 5.42,63.26 6.81,63.26 7.33,62.74 ZH1.5-2A#3.1
IO13: length 7.3
  Top Layer w0.254: ZH1.5-3A.3 24.6,20.57 31.68,20.57 ESP32-S3-WROOM.21
IO13_1: length 25.1
  Top Layer w0.254: ZH1.5-3A#3.3 16.06,25.77 7.15,16.86
IO14: length 7.4
  Top Layer w0.254: v1(31.71,19.32) ESP32-S3-WROOM.22
  Bottom Layer w0.254: ZH1.5-3A.2 25.23,18.94 25.61,19.32 v1(31.71,19.32)
IO14_1: length 10.8
  Top Layer w0.254: 7.15,32.36 10.33,32.36 14.56,36.59 ZH1.5-3A#3.2
IO19: length 7
  Top Layer w0.254: R10.2 33.74,31.76 34.25,31.25 ESP32-S3-WROOM.13
IO19_1: length 2.5
  Top Layer w0.254: U12.23 67.28,20.88 R16#2.1
IO20: length 4.2
  Top Layer w0.254: R9.2 32.97,29.98 ESP32-S3-WROOM.14
IO20_1: length 2.5
  Top Layer w0.254: U12.24 66.43,20.92 R16.1
LED_+: length 2
  Top Layer w0.254: R19.2 49.86,4.89 LED.2
LED_P: length 2.6
  Top Layer w0.254: 40.1,45.37 40.76,44.72 40.84,44.72 R13.1
MISO: length 13.5
  Top Layer w0.254: v1(42.04,34.58) 41.99,34.63 v1(41.99,40.54)
  Bottom Layer w0.254: v1(40.6,29.97) 40.6,32.15 42.04,33.59 v1(42.04,34.58) ; 42,40.54 v1(41.99,40.54) 41.12,40.54 PAW3395DM.12
MOSI: length 9.3
  Bottom Layer w0.254: 40.1,37.84 41.46,36.49 41.46,33.52 39.33,31.39 v1(39.33,29.97)
MOTION: length 5.8
  Bottom Layer w0.254: v1(36.79,29.97) 36.79,30.37 40.1,33.68 40.1,34.44
NCS: length 13.8
  Top Layer w0.254: v1(41.87,32.4) 42.63,33.16 42.63,40.72 42.07,41.29 40.12,41.29 PAW3395DM.13
  Bottom Layer w0.254: v1(41.87,32.4) 41.87,29.98 v1(41.87,29.97)
NRESET: length 15
  Top Layer w0.254: PAW3395DM.14 41.08,43.08 42.98,41.18 42.98,32.49 v1(42.89,32.4)
  Bottom Layer w0.254: v1(42.89,32.4) 42.88,32.39 42.88,30.23 v1(43.14,29.97)
SCLK: length 7.8
  Bottom Layer w0.254: v1(38.06,29.97) 38.06,30.62 41.1,33.66 41.1,35.06 40.1,36.07
SW: length 1.8
  Bottom Layer w0.254: U6.7 46.82,52.4 46.75,52.34

## Copper pours and planes (outline as drawn; the poured copper is in the pictures)
GND on Top Layer: 49.74,85.96 49.74,81.96 55.43,81.96 55.43,0.1 22.06,0.1 22.06,59.93 13.83,59.93 13.83,81.96 19.83,81.96 19.83,85.96 29.58,85.96 29.58,89.5 39.96,89.5 39.96,85.96
GND on Bottom Layer: 49.74,86.15 49.74,82.15 55.68,82.15 55.68,0.3 21.68,0.3 21.68,60.12 13.83,60.12 13.83,82.15 19.83,82.15 19.83,86.15 29.58,86.15 29.58,89.69 39.96,89.69 39.96,86.15
GND_1 on Top Layer: 3.77,45.73 17.81,45.73 17.81,13.73 3.77,13.73
GND_1 on Bottom Layer: 3.77,45.73 17.81,45.73 17.81,13.73 3.77,13.73
GND_2 on Top Layer: 59.81,45.63 75.05,45.63 75.05,4.08 59.81,4.08
GND_2 on Bottom Layer: 59.66,45.63 75.16,45.63 75.16,4.08 59.66,4.08
GND_3 on Top Layer: 0,83.32 10.44,83.32 10.44,60.38 0,60.38
GND_3 on Bottom Layer: 0,83.32 10.44,83.32 10.44,60.38 0,60.38
GND_4 on Top Layer: 59.03,84.72 69.47,84.72 69.47,61.78 59.03,61.78
GND_4 on Bottom Layer: 59.03,84.72 69.47,84.72 69.47,61.78 59.03,61.78

Small or netless copper shapes (teardrops, artwork), in the pictures only: 159 on Top Layer, 136 on Bottom Layer
